# EAGLE design kfly_v3.0 (EAGLE 6.5.0)

## Sheet 1 of 8: MCU
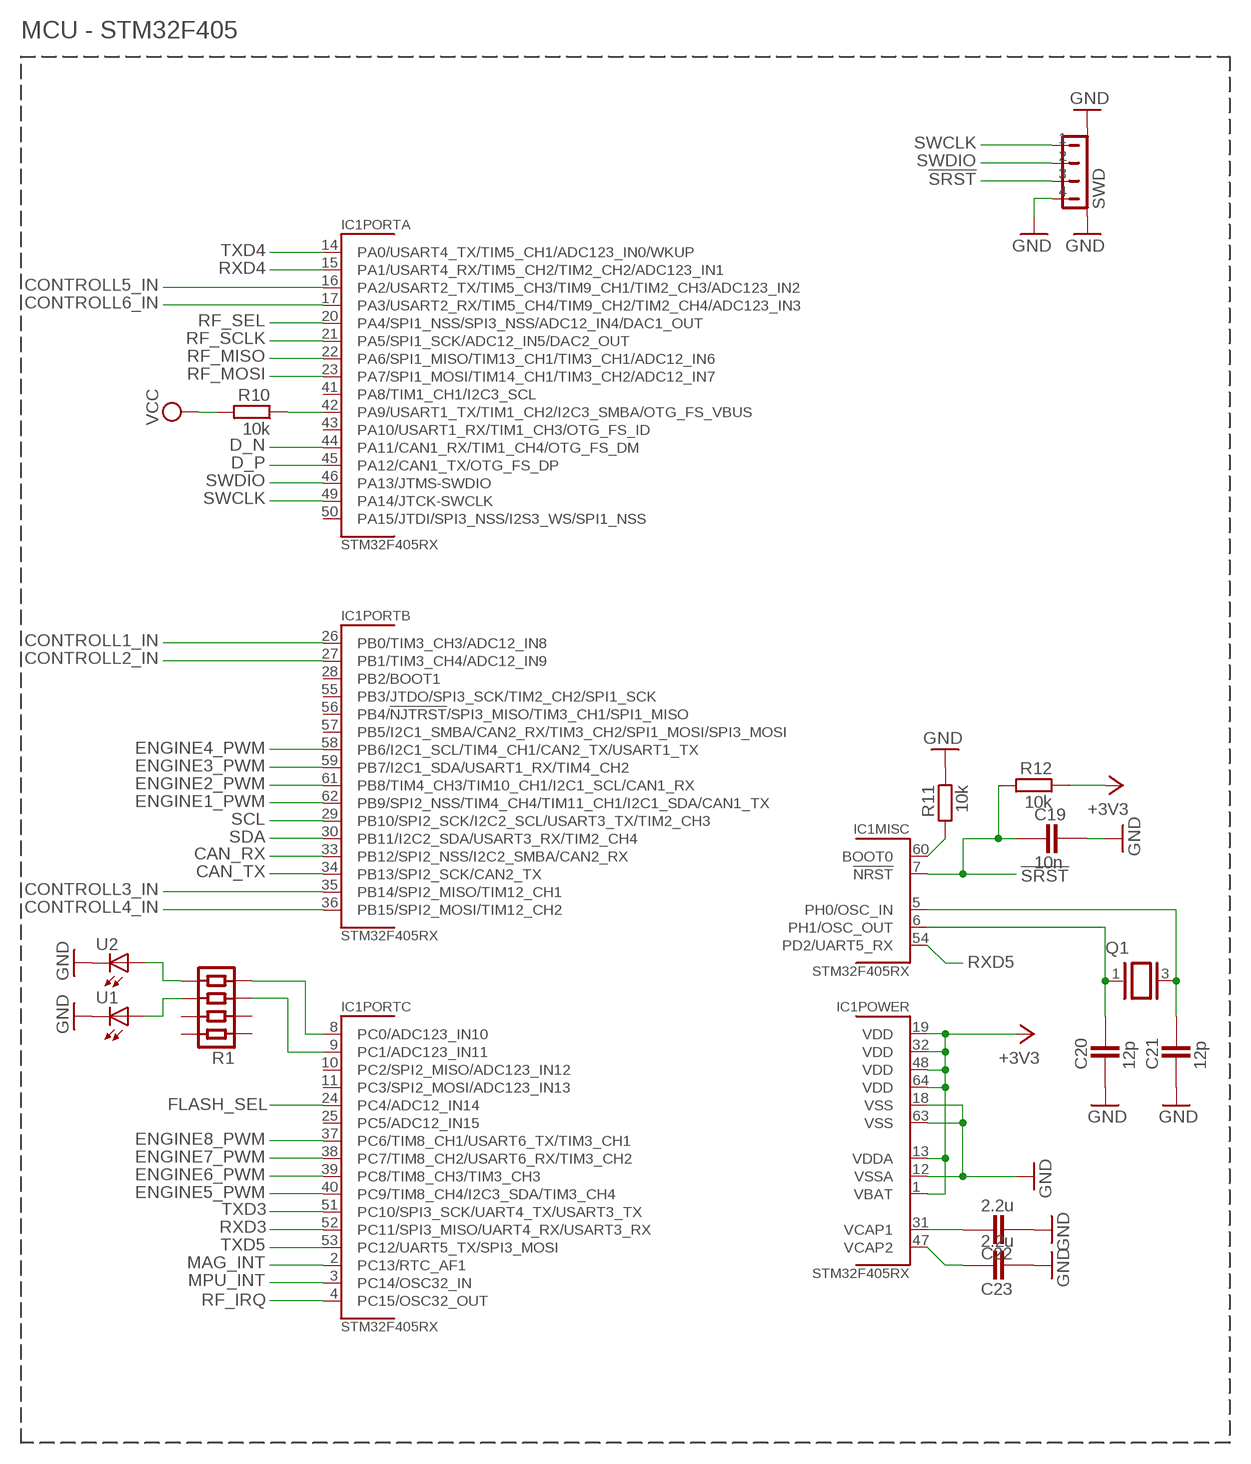
[diagram p0: schematic, sheet 1]

### Parts
C19  10n  CAPACITOR_0402  [CAPC1005X60N]
C20  12p  CAPACITOR_0402  [CAPC1005X60N]
C21  12p  CAPACITOR_0402  [CAPC1005X60N]
C22  2.2u  CAPACITOR_0603  [CAPC1608X92N]
C23  2.2u  CAPACITOR_0603  [CAPC1608X92N]
IC1  STM32F405RX  STM32F4X5RX  [LQFP64-10X10]
Q1  2.5X3.2CRYSTAL  [2.5X3.2CRYSTAL]
R1  RESISTOR-4ARRAY-0804  [RESISTORARRAY_0804]
R10  10k  RESISTOR_0402  [RESC1005X40AN]
R11  10k  RESISTOR_0402  [RESC1005X40AN]
R12  10k  RESISTOR_0402  [RESC1005X40AN]
SWD  JST-4PIN-SIDE-1.0  [JST-4PIN-SIDE]
U1  LED0603  [LED-0603]
U2  LED0603  [LED-0603]

### Nets
!SRST: C19.1 IC1.7(MISC:!NRST!) R12.2 SWD.3
+3V3: IC1.1(POWER:VBAT) IC1.13(POWER:VDDA) IC1.19(POWER:VDD) IC1.32(POWER:VDD) IC1.48(POWER:VDD) IC1.64(POWER:VDD) R12.1 ; also sheet 2,3,4,6,8
CAN_RX: IC1.33(PORTB:PB12/SPI2_NSS/I2C2_SMBA/CAN2_RX) ; also sheet 6
CAN_TX: IC1.34(PORTB:PB13/SPI2_SCK/CAN2_TX) ; also sheet 6
CONTROLL1_IN: IC1.26(PORTB:PB0/TIM3_CH3/ADC12_IN8) ; also sheet 6
CONTROLL2_IN: IC1.27(PORTB:PB1/TIM3_CH4/ADC12_IN9) ; also sheet 6
CONTROLL3_IN: IC1.35(PORTB:PB14/SPI2_MISO/TIM12_CH1) ; also sheet 6
CONTROLL4_IN: IC1.36(PORTB:PB15/SPI2_MOSI/TIM12_CH2) ; also sheet 6
CONTROLL5_IN: IC1.16(PORTA:PA2/USART2_TX/TIM5_CH3/TIM9_CH1/TIM2_CH3/ADC123_IN2) ; also sheet 6
CONTROLL6_IN: IC1.17(PORTA:PA3/USART2_RX/TIM5_CH4/TIM9_CH2/TIM2_CH4/ADC123_IN3) ; also sheet 6
D_N: IC1.44(PORTA:PA11/CAN1_RX/TIM1_CH4/OTG_FS_DM) ; also sheet 5
D_P: IC1.45(PORTA:PA12/CAN1_TX/OTG_FS_DP) ; also sheet 5
ENGINE1_PWM: IC1.62(PORTB:PB9/SPI2_NSS/TIM4_CH4/TIM11_CH1/I2C1_SDA/CAN1_TX) ; also sheet 7
ENGINE2_PWM: IC1.61(PORTB:PB8/TIM4_CH3/TIM10_CH1/I2C1_SCL/CAN1_RX) ; also sheet 7
ENGINE3_PWM: IC1.59(PORTB:PB7/I2C1_SDA/USART1_RX/TIM4_CH2) ; also sheet 7
ENGINE4_PWM: IC1.58(PORTB:PB6/I2C1_SCL/TIM4_CH1/CAN2_TX/USART1_TX) ; also sheet 7
ENGINE5_PWM: IC1.40(PORTC:PC9/TIM8_CH4/I2C3_SDA/TIM3_CH4) ; also sheet 7
ENGINE6_PWM: IC1.39(PORTC:PC8/TIM8_CH3/TIM3_CH3) ; also sheet 7
ENGINE7_PWM: IC1.38(PORTC:PC7/TIM8_CH2/USART6_RX/TIM3_CH2) ; also sheet 7
ENGINE8_PWM: IC1.37(PORTC:PC6/TIM8_CH1/USART6_TX/TIM3_CH1) ; also sheet 7
FLASH_SEL: IC1.24(PORTC:PC4/ADC12_IN14) ; also sheet 3
GND: C19.2 C20.1 C21.1 C22.2 C23.2 IC1.12(POWER:VSSA) IC1.18(POWER:VSS) IC1.63(POWER:VSS) R11.1 SWD.4 SWD.NC1(P1) SWD.NC2(P2) U1.C U2.C ; also sheet 2,3,4,5,6,7,8
MAG_INT: IC1.2(PORTC:PC13/RTC_AF1) ; also sheet 4
MPU_INT: IC1.3(PORTC:PC14/OSC32_IN) ; also sheet 4
N$11: R1.5 U2.A
N$18: R1.6 U1.A
N$19: IC1.60(MISC:BOOT0) R11.2
N$20: IC1.8(PORTC:PC0/ADC123_IN10) R1.4
N$24: IC1.9(PORTC:PC1/ADC123_IN11) R1.3
N$25: C20.2 IC1.6(MISC:PH1/OSC_OUT) Q1.1
N$26: C21.2 IC1.5(MISC:PH0/OSC_IN) Q1.3
N$35: IC1.42(PORTA:PA9/USART1_TX/TIM1_CH2/I2C3_SMBA/OTG_FS_VBUS) R10.1
N$44: C22.1 IC1.31(POWER:VCAP1)
N$50: C23.1 IC1.47(POWER:VCAP2)
RF_IRQ: IC1.4(PORTC:PC15/OSC32_OUT) ; also sheet 8
RF_MISO: IC1.22(PORTA:PA6/SPI1_MISO/TIM13_CH1/TIM3_CH1/ADC12_IN6) ; also sheet 3,8
RF_MOSI: IC1.23(PORTA:PA7/SPI1_MOSI/TIM14_CH1/TIM3_CH2/ADC12_IN7) ; also sheet 3,8
RF_SCLK: IC1.21(PORTA:PA5/SPI1_SCK/ADC12_IN5/DAC2_OUT) ; also sheet 3,8
RF_SEL: IC1.20(PORTA:PA4/SPI1_NSS/SPI3_NSS/ADC12_IN4/DAC1_OUT) ; also sheet 8
RXD3: IC1.52(PORTC:PC11/SPI3_MISO/UART4_RX/USART3_RX) ; also sheet 6
RXD4: IC1.15(PORTA:PA1/USART4_RX/TIM5_CH2/TIM2_CH2/ADC123_IN1) ; also sheet 6
RXD5: IC1.54(MISC:PD2/UART5_RX) ; also sheet 6
SCL: IC1.29(PORTB:PB10/SPI2_SCK/I2C2_SCL/USART3_TX/TIM2_CH3) ; also sheet 4
SDA: IC1.30(PORTB:PB11/I2C2_SDA/USART3_RX/TIM2_CH4) ; also sheet 4
SWCLK: IC1.49(PORTA:PA14/JTCK-SWCLK) SWD.1
SWDIO: IC1.46(PORTA:PA13/JTMS-SWDIO) SWD.2
TXD3: IC1.51(PORTC:PC10/SPI3_SCK/UART4_TX/USART3_TX) ; also sheet 6
TXD4: IC1.14(PORTA:PA0/USART4_TX/TIM5_CH1/ADC123_IN0/WKUP) ; also sheet 6
TXD5: IC1.53(PORTC:PC12/UART5_TX/SPI3_MOSI) ; also sheet 6
VCC: R10.2 ; also sheet 2,5
Unconnected: IC1.10(PORTC:PC2/SPI2_MISO/ADC123_IN12) IC1.11(PORTC:PC3/SPI2_MOSI/ADC123_IN13) IC1.25(PORTC:PC5/ADC12_IN15) IC1.28(PORTB:PB2/BOOT1) IC1.41(PORTA:PA8/TIM1_CH1/I2C3_SCL) IC1.43(PORTA:PA10/USART1_RX/TIM1_CH3/OTG_FS_ID) IC1.50(PORTA:PA15/JTDI/SPI3_NSS/I2S3_WS/SPI1_NSS) IC1.55(PORTB:PB3/JTDO/SPI3_SCK/TIM2_CH2/SPI1_SCK) IC1.56(PORTB:PB4/!NJTRST!/SPI3_MISO/TIM3_CH1/SPI1_MISO) IC1.57(PORTB:PB5/I2C1_SMBA/CAN2_RX/TIM3_CH2/SPI1_MOSI/SPI3_MOSI) R1.1 R1.2 R1.7 R1.8

### Notes on the sheet
- MCU - STM32F405

## Sheet 2 of 8: Power supply
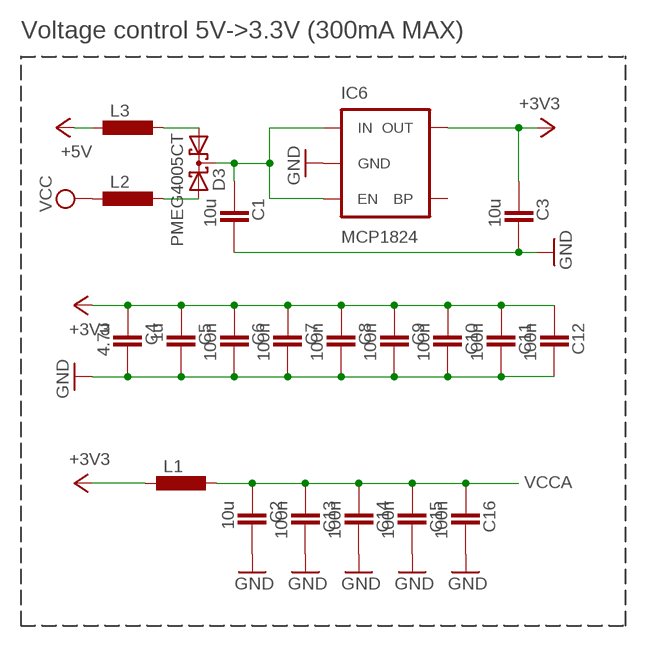
[diagram p1: schematic, sheet 2]

### Parts
C1  10u  CAPACITOR_0603  [CAPC1608X92N]
C2  10u  CAPACITOR_0603  [CAPC1608X92N]
C3  10u  CAPACITOR_0603  [CAPC1608X92N]
C4  4.7u  CAPACITOR_0603  [CAPC1608X92N]
C5  1u  CAPACITOR_0603  [CAPC1608X92N]
C6  100n  CAPACITOR_0402  [CAPC1005X60N]
C7  100n  CAPACITOR_0402  [CAPC1005X60N]
C8  100n  CAPACITOR_0402  [CAPC1005X60N]
C9  100n  CAPACITOR_0402  [CAPC1005X60N]
C10  100n  CAPACITOR_0402  [CAPC1005X60N]
C11  100n  CAPACITOR_0402  [CAPC1005X60N]
C12  100n  CAPACITOR_0402  [CAPC1005X60N]
C13  100n  CAPACITOR_0402  [CAPC1005X60N]
C14  100n  CAPACITOR_0402  [CAPC1005X60N]
C15  100n  CAPACITOR_0402  [CAPC1005X60N]
C16  100n  CAPACITOR_0402  [CAPC1005X60N]
D3  PMEG4005CT  BAS40-05  [SOT23]
IC6  MCP1824  V_REG_LDOSMD  [SOT23-5]
L1  INDUCTOR_0603  [INDC1608X95N]
L2  INDUCTOR_0603  [INDC1608X95N]
L3  INDUCTOR_0603  [INDC1608X95N]

### Nets
+3V3: C3.1 C4.1 C5.1 C6.1 C7.1 C8.1 C9.1 C10.1 C11.1 C12.1 IC6.5(OUT) L1.1 ; also sheet 1,3,4,6,8
+5V: L3.1 ; also sheet 6,7
GND: C1.2 C2.2 C3.2 C4.2 C5.2 C6.2 C7.2 C8.2 C9.2 C10.2 C11.2 C12.2 C13.2 C14.2 C15.2 C16.2 IC6.2(GND) ; also sheet 1,3,4,5,6,7,8
N$21: D3.2(A2) L2.2
N$45: D3.1(A1) L3.2
V_RC: C1.1 D3.3(C) IC6.1(IN) IC6.3(EN)
VCC: L2.1 ; also sheet 1,5
VCCA: C2.1 C13.1 C14.1 C15.1 C16.1 L1.2 ; also sheet 4
Unconnected: IC6.4(BP)

### Notes on the sheet
- Voltage control 5V->3.3V (300mA MAX)

## Sheet 3 of 8: Flash Memory
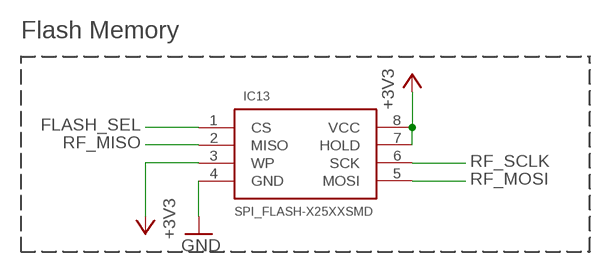
[diagram p2: schematic, sheet 3]

### Parts
IC13  SPI_FLASH-X25XXSMD  [SO08]

### Nets
+3V3: IC13.3(WP) IC13.7(HOLD) IC13.8(VCC) ; also sheet 1,2,4,6,8
FLASH_SEL: IC13.1(CS) ; also sheet 1
GND: IC13.4(GND) ; also sheet 1,2,4,5,6,7,8
RF_MISO: IC13.2(MISO) ; also sheet 1,8
RF_MOSI: IC13.5(MOSI) ; also sheet 1,8
RF_SCLK: IC13.6(SCK) ; also sheet 1,8

### Notes on the sheet
- Flash Memory

## Sheet 4 of 8: Sensors and their power suppy
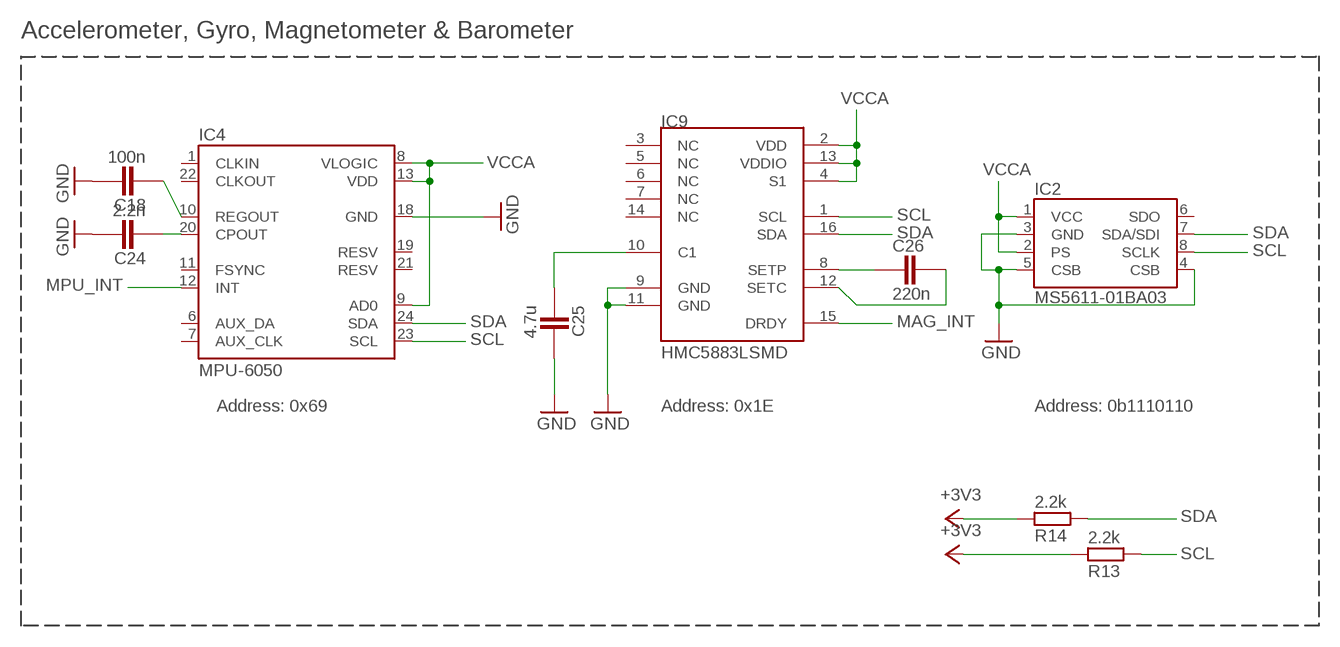
[diagram p3: schematic, sheet 4]

### Parts
C18  100n  CAPACITOR_0402  [CAPC1005X60N]
C24  2.2n  CAPACITOR_0402  [CAPC1005X60N]
C25  4.7u  CAPACITOR_0603  [CAPC1608X92N]
C26  220n  CAPACITOR_0603  [CAPC1608X92N]
IC2  MS5611-01BA03  MS5611-01BA01  [MS5611]
IC4  MPU-6050  [QFN-24]
IC9  HMC5883LSMD  [16LPCC]
R13  2.2k  RESISTOR_0402  [RESC1005X40AN]
R14  2.2k  RESISTOR_0402  [RESC1005X40AN]

### Nets
+3V3: R13.1 R14.1 ; also sheet 1,2,3,6,8
GND: C18.2 C24.2 C25.2 IC2.3(GND) IC2.4(CSB) IC2.5(CSB) IC4.18(GND) IC9.9(GND) IC9.11(GND) ; also sheet 1,2,3,5,6,7,8
MAG_INT: IC9.15(DRDY) ; also sheet 1
MPU_INT: IC4.12(INT) ; also sheet 1
N$1: C25.1 IC9.10(C1)
N$8: C26.1 IC9.8(SETP)
N$10: C26.2 IC9.12(SETC)
N$13: C18.1 IC4.10(REGOUT)
N$14: C24.1 IC4.20(CPOUT)
SCL: IC2.8(SCLK) IC4.23(SCL) IC9.1(SCL) R13.2 ; also sheet 1
SDA: IC2.7(SDA/SDI) IC4.24(SDA) IC9.16(SDA) R14.2 ; also sheet 1
VCCA: IC2.1(VCC) IC2.2(PS) IC4.8(VLOGIC) IC4.9(AD0) IC4.13(VDD) IC9.2(VDD) IC9.4(S1) IC9.13(VDDIO) ; also sheet 2
Unconnected: IC2.6(SDO) IC4.1(CLKIN) IC4.6(AUX_DA) IC4.7(AUX_CLK) IC4.11(FSYNC) IC4.19(RESV) IC4.21(RESV) IC4.22(CLKOUT) IC9.3(NC) IC9.5(NC) IC9.6(NC) IC9.7(NC) IC9.14(NC)

### Notes on the sheet
- Accelerometer, Gyro, Magnetometer & Barometer
- Address: 0x69 | Address: 0x1E | Address: 0b1110110

## Sheet 5 of 8: USB and JTAG
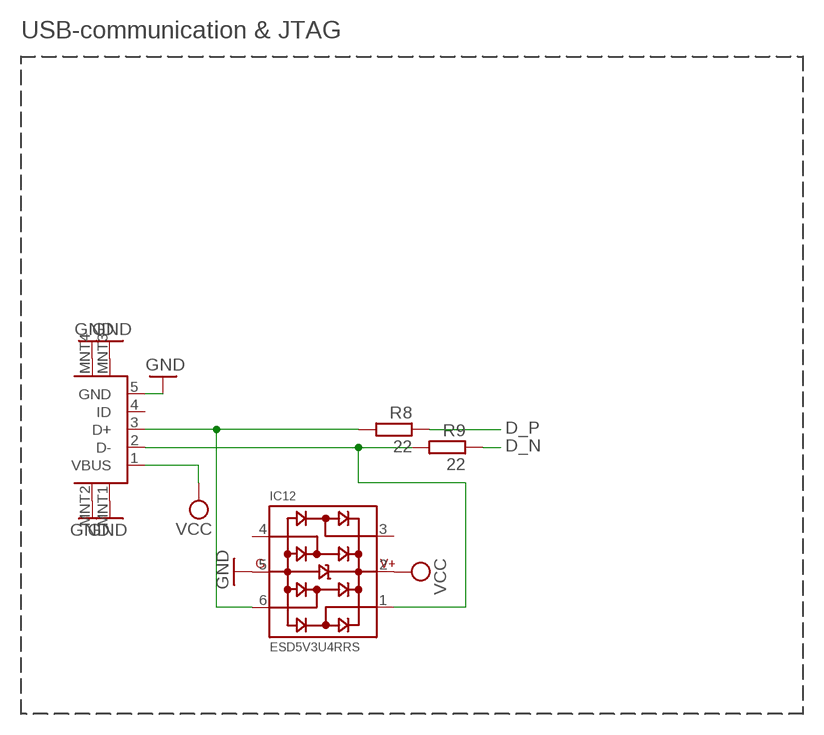
[diagram p4: schematic, sheet 5]

### Parts
IC12  ESD5V3U4RRS  [SOT363]
R8  22  RESISTOR_0402  [RESC1005X40AN]
R9  22  RESISTOR_0402  [RESC1005X40AN]
USB1  USB-MICRO-B-BOTTOM  [MICROUSB_TYPEB_SURFACE]

### Nets
D_N: R9.1 ; also sheet 1
D_P: R8.1 ; also sheet 1
GND: IC12.5 USB1.5(GND) USB1.MNT1(MTN1) USB1.MNT2(MTN2) USB1.MNT3(MTN3) USB1.MNT4(MTN4) ; also sheet 1,2,3,4,6,7,8
N$2: IC12.6 R8.2 USB1.3(D+)
N$7: IC12.1 R9.2 USB1.2(D-)
VCC: IC12.2 USB1.1(VBUS) ; also sheet 1,2
Unconnected: IC12.3 IC12.4 USB1.4(ID)

### Notes on the sheet
- USB-communication & JTAG

## Sheet 6 of 8: Communication Input and Outputs
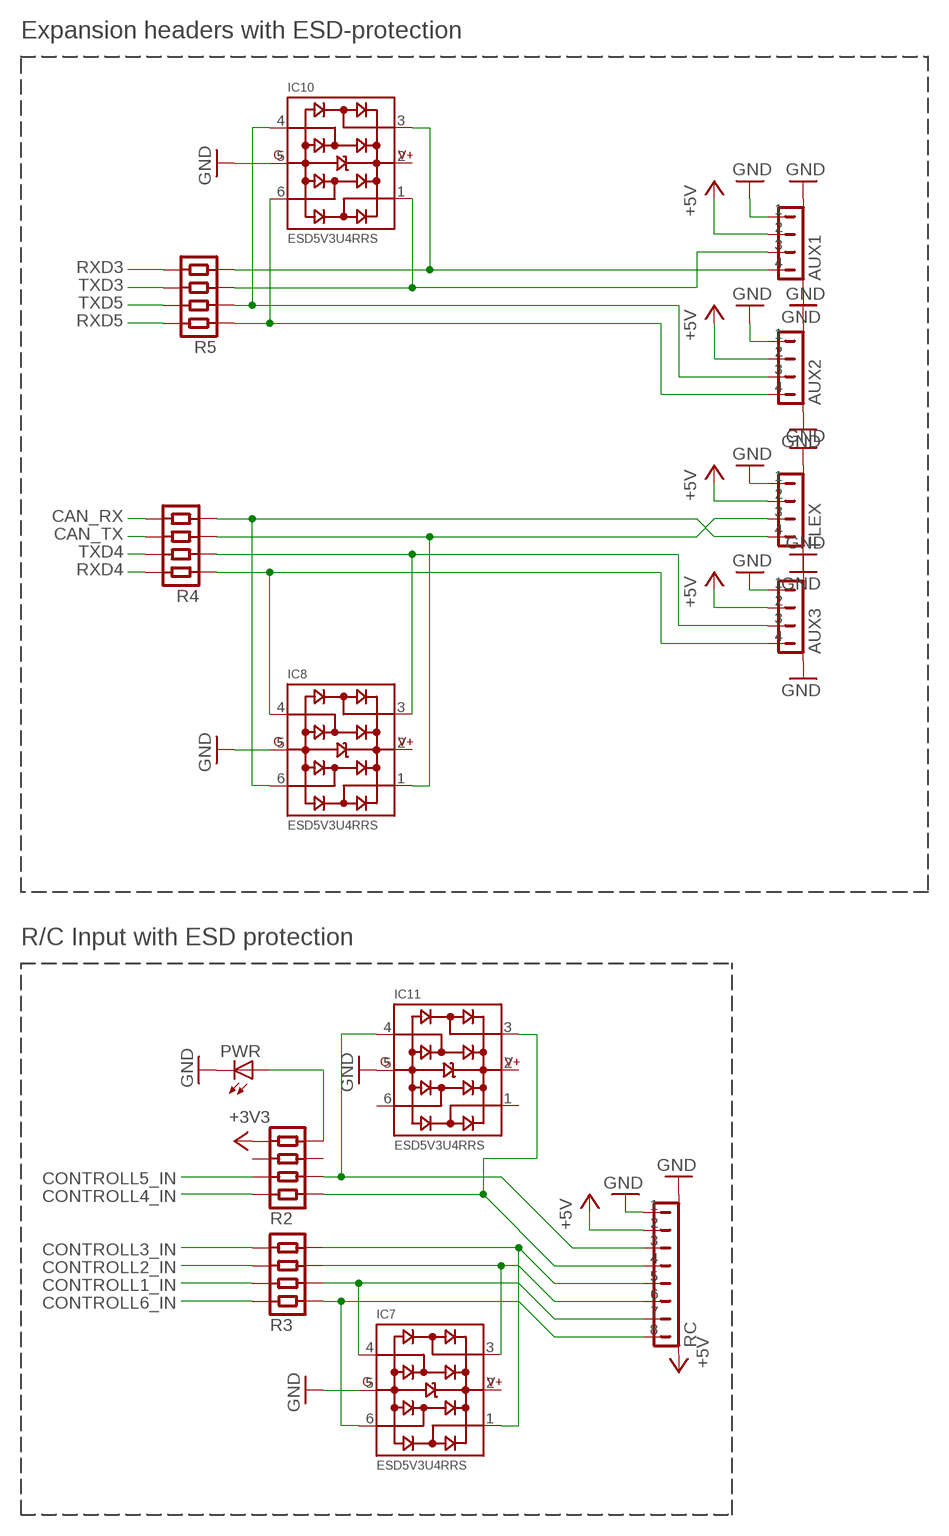
[diagram p5: schematic, sheet 6]

### Parts
AUX1  JST-4PIN-SIDE-1.0  [JST-4PIN-SIDE]
AUX2  JST-4PIN-SIDE-1.0  [JST-4PIN-SIDE]
AUX3  JST-4PIN-SIDE-1.0  [JST-4PIN-SIDE]
FLEX  JST-4PIN-SIDE-1.0  [JST-4PIN-SIDE]
IC7  ESD5V3U4RRS  [SOT363]
IC8  ESD5V3U4RRS  [SOT363]
IC10  ESD5V3U4RRS  [SOT363]
IC11  ESD5V3U4RRS  [SOT363]
PWR  LED0603  [LED-0603]
R2  RESISTOR-4ARRAY-0804  [RESISTORARRAY_0804]
R3  RESISTOR-4ARRAY-0804  [RESISTORARRAY_0804]
R4  RESISTOR-4ARRAY-0804  [RESISTORARRAY_0804]
R5  RESISTOR-4ARRAY-0804  [RESISTORARRAY_0804]
RC  JST-8PIN-SIDE-1.0  [JST-8PIN-SIDE]

### Nets
+3V3: R2.4 ; also sheet 1,2,3,4,8
+5V: AUX1.2 AUX2.2 AUX3.2 FLEX.2 RC.2 RC.NC2(GND2) ; also sheet 2,7
CAN_RX: R4.5 ; also sheet 1
CAN_TX: R4.6 ; also sheet 1
CONTROLL1_IN: R3.2 ; also sheet 1
CONTROLL2_IN: R3.3 ; also sheet 1
CONTROLL3_IN: R3.4 ; also sheet 1
CONTROLL4_IN: R2.1 ; also sheet 1
CONTROLL5_IN: R2.2 ; also sheet 1
CONTROLL6_IN: R3.1 ; also sheet 1
GND: AUX1.1 AUX1.NC1(P1) AUX1.NC2(P2) AUX2.1 AUX2.NC1(P1) AUX2.NC2(P2) AUX3.1 AUX3.NC1(P1) AUX3.NC2(P2) FLEX.1 FLEX.NC1(P1) FLEX.NC2(P2) IC7.5 IC8.5 IC10.5 IC11.5 PWR.C RC.1 RC.NC1(GND1) ; also sheet 1,2,3,4,5,7,8
N$6: AUX2.3 IC10.4 R5.2
N$9: PWR.A R2.5
N$23: IC11.4 R2.7 RC.3
N$27: IC7.6 R3.8 RC.8
N$28: IC7.1 R3.5 RC.5
N$30: FLEX.4 IC8.6 R4.4
N$31: FLEX.3 IC8.1 R4.3
N$40: AUX2.4 IC10.6 R5.1
N$46: IC11.3 R2.8 RC.4
N$49: IC7.3 R3.6 RC.6
N$51: AUX1.4 IC10.3 R5.4
N$52: AUX1.3 IC10.1 R5.3
N$55: AUX3.4 IC8.4 R4.1
N$70: AUX3.3 IC8.3 R4.2
N$78: IC7.4 R3.7 RC.7
RXD3: R5.5 ; also sheet 1
RXD4: R4.8 ; also sheet 1
RXD5: R5.8 ; also sheet 1
TXD3: R5.6 ; also sheet 1
TXD4: R4.7 ; also sheet 1
TXD5: R5.7 ; also sheet 1
Unconnected: IC7.2 IC8.2 IC10.2 IC11.1 IC11.2 IC11.6 R2.3 R2.6

### Notes on the sheet
- Expansion headers with ESD-protection
- R/C Input with ESD protection

## Sheet 7 of 8: PPM out
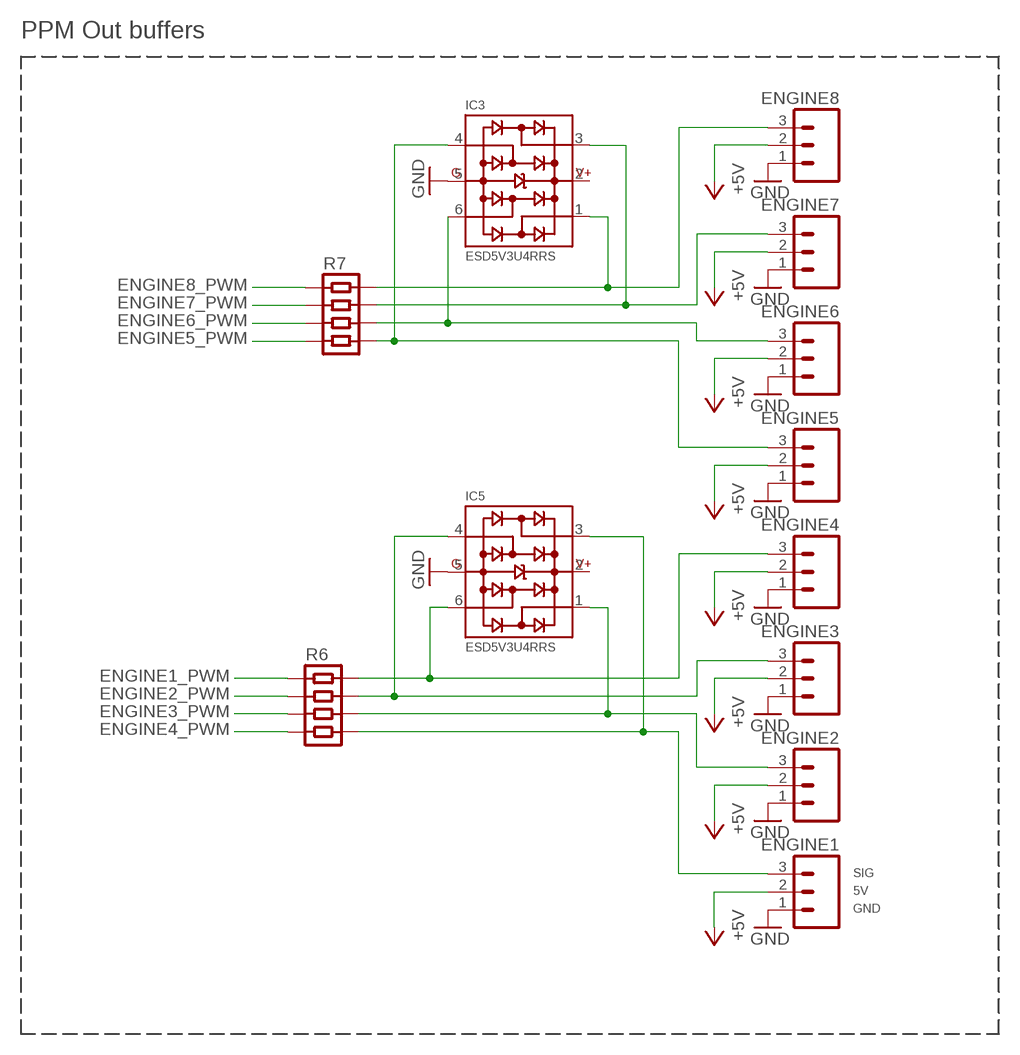
[diagram p6: schematic, sheet 7]

### Parts
ENGINE1  M03  [M03]
ENGINE2  M03  [M03]
ENGINE3  M03  [M03]
ENGINE4  M03  [M03]
ENGINE5  M03  [M03]
ENGINE6  M03  [M03]
ENGINE7  M03  [M03]
ENGINE8  M03  [M03]
IC3  ESD5V3U4RRS  [SOT363]
IC5  ESD5V3U4RRS  [SOT363]
R6  RESISTOR-4ARRAY-0804  [RESISTORARRAY_0804]
R7  RESISTOR-4ARRAY-0804  [RESISTORARRAY_0804]

### Nets
+5V: ENGINE1.2 ENGINE2.2 ENGINE3.2 ENGINE4.2 ENGINE5.2 ENGINE6.2 ENGINE7.2 ENGINE8.2 ; also sheet 2,6
ENGINE1_PWM: R6.1 ; also sheet 1
ENGINE2_PWM: R6.2 ; also sheet 1
ENGINE3_PWM: R6.3 ; also sheet 1
ENGINE4_PWM: R6.4 ; also sheet 1
ENGINE5_PWM: R7.4 ; also sheet 1
ENGINE6_PWM: R7.3 ; also sheet 1
ENGINE7_PWM: R7.2 ; also sheet 1
ENGINE8_PWM: R7.1 ; also sheet 1
GND: ENGINE1.1 ENGINE2.1 ENGINE3.1 ENGINE4.1 ENGINE5.1 ENGINE6.1 ENGINE7.1 ENGINE8.1 IC3.5 IC5.5 ; also sheet 1,2,3,4,5,6,8
N$3: ENGINE8.3 IC3.1 R7.8
N$4: ENGINE7.3 IC3.3 R7.7
N$5: ENGINE6.3 IC3.6 R7.6
N$12: ENGINE5.3 IC3.4 R7.5
N$16: ENGINE2.3 IC5.1 R6.6
N$17: ENGINE1.3 IC5.3 R6.5
N$22: ENGINE4.3 IC5.6 R6.8
N$29: ENGINE3.3 IC5.4 R6.7
Unconnected: IC3.2 IC5.2

### Notes on the sheet
- PPM Out buffers
- SIG
- 5V
- GND

## Sheet 8 of 8: RF
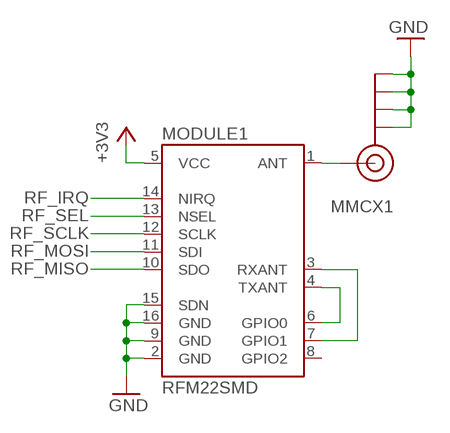
[diagram p7: schematic, sheet 8]

### Parts
MMCX1  MMCX  [MMCX_THROUGHHOLE_RIGHTANGLE]
MODULE1  RFM22SMD  [RFM22-XXX-S2]

### Nets
+3V3: MODULE1.5(VCC) ; also sheet 1,2,3,4,6
GND: MMCX1.G1(GND) MMCX1.G2(GND) MMCX1.G3(GND) MMCX1.G4(GND) MODULE1.2(GND) MODULE1.9(GND) MODULE1.15(SDN) MODULE1.16(GND) ; also sheet 1,2,3,4,5,6,7
N$56: MMCX1.S(SIGNAL) MODULE1.1(ANT)
N$67: MODULE1.4(TXANT) MODULE1.6(GPIO0)
N$68: MODULE1.3(RXANT) MODULE1.7(GPIO1)
RF_IRQ: MODULE1.14(NIRQ) ; also sheet 1
RF_MISO: MODULE1.10(SDO) ; also sheet 1,3
RF_MOSI: MODULE1.11(SDI) ; also sheet 1,3
RF_SCLK: MODULE1.12(SCLK) ; also sheet 1,3
RF_SEL: MODULE1.13(NSEL) ; also sheet 1
Unconnected: MODULE1.8(GPIO2)

## Library data of the parts
AUX1-AUX3 FLEX SWD = korken:JST-4PIN-SIDE-1.0
C1-C16 C18-C26 = ipc-7351-capacitor:CAPACITOR_
D3 = diode:BAS40-05: Silicon Schottky Diodes General-purpose diode for high-speed switching
ENGINE1-ENGINE8 = korken:M03
IC1 = korken:STM32F4X5RX
IC2 = korken:MS5611-01BA01
IC3 IC5 IC7 IC8 IC10-IC12 = korken:ESD5V3U4RRS
IC4 = korken:MPU-6050
IC6 = SparkFun:V_REG_LDO: Voltage Regulator LDO Standard 150mA LDO voltage regulator in SOT-23 layout. Micrel part MIC5205. BP (by-pass) pin is used to lower output noise with 470pF cap.
IC9 = SparkFun:HMC5883L: 3 Axis Digital Compass IC
IC13 = SparkFun:SPI_FLASH-X25XX: 8pin SPI Flash series x25xx. Works with devices like W25X32 and BR25L32
L1-L3 = ipc-7351-inductor:INDUCTOR_
MMCX1 = korken:MMCX
MODULE1 = SparkFun:RFM22: Description: The RFM22 is a low-power, low cost radio that is capable of operating in the 434MHz and 900MHz open bands. It's frequency is software defined and there are some very good libraries written for it.
PWR U1 U2 = SparkFun:LED: LEDs Standard schematic elements and footprints for 5mm, 3mm, 1206, and 0603 sized LEDs. 5mm - Spark Fun Electronics SKU : COM-00529 (and others)
Q1 = korken:2.5X3.2CRYSTAL
R1-R7 = korken:RESISTOR-4ARRAY-0804
R8-R14 = ipc-7351-resistor:RESISTOR_
RC = korken:JST-8PIN-SIDE-1.0
USB1 = korken:USB-MICRO-B-BOTTOM

## Board
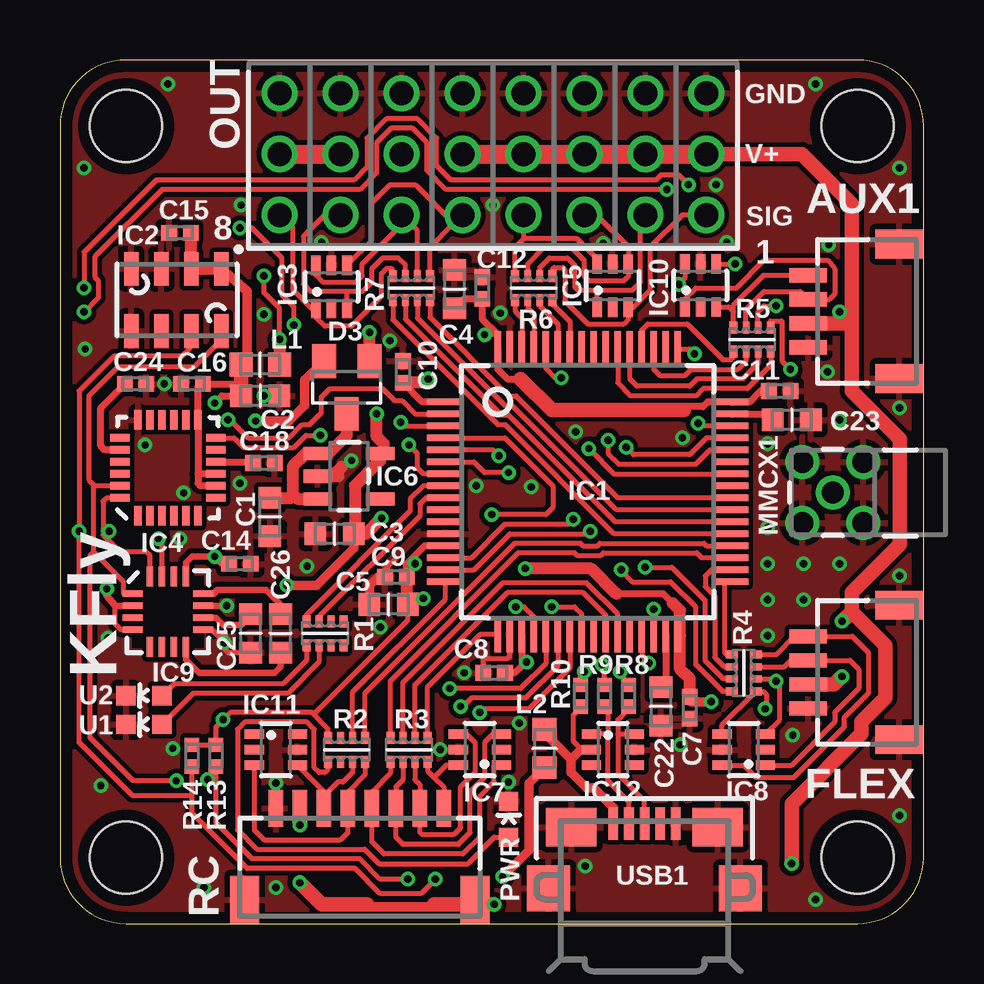
[diagram p8: board, top side]
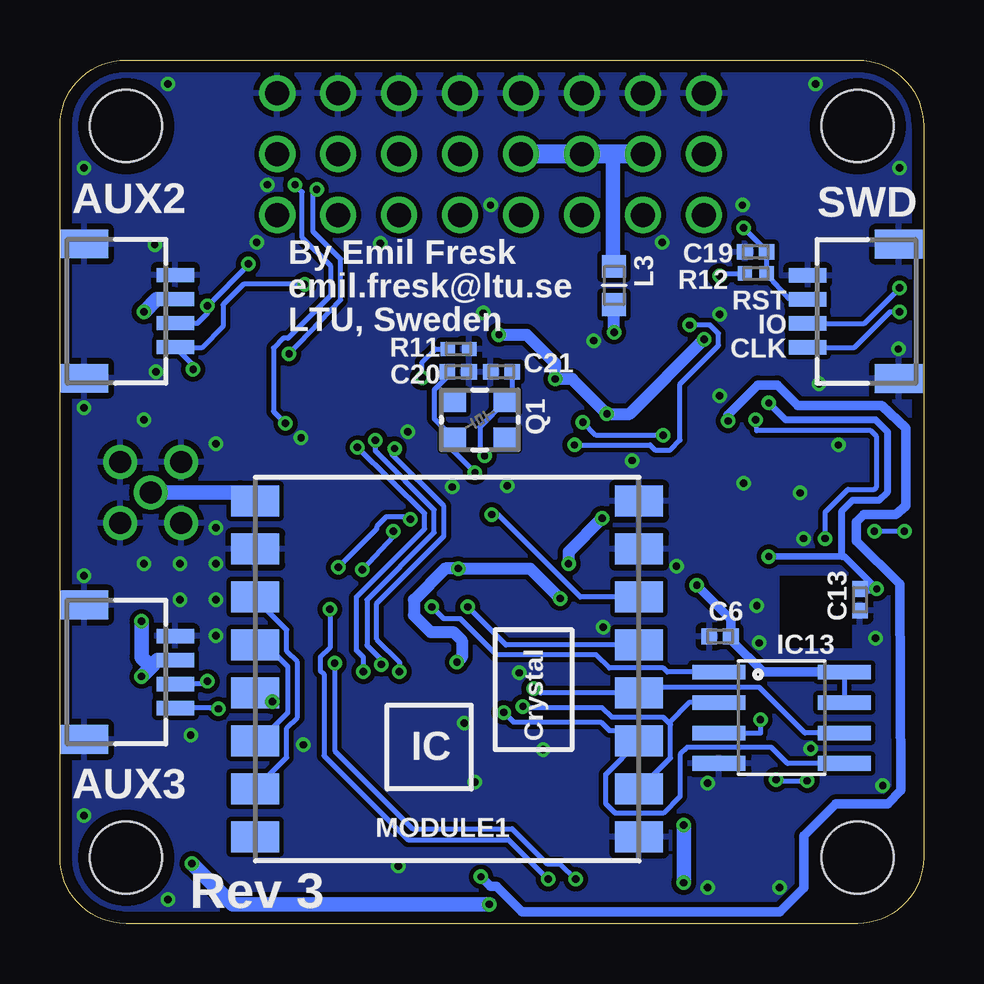
[diagram p9: board, bottom side, seen from below]

Size 36 x 36 mm. Coordinates in mm from the lower left corner, seen from the top.
Outline: 0,33.25 0,2.75 arc90 2.75,0 33.25,0 arc90 36,2.75 36,33.25 arc90 33.25,36 2.75,36 arc90 0,33.25
Copper layers (1*2*15*16): Top 0.035mm / dielectric 0.4mm / InnerTop 0.035mm / dielectric 0.4mm / InnerBottom 0.035mm / dielectric 0.4mm / Bottom 0.035mm
Design rules "korken_default *": minimum track width 0.15mm, minimum drill 0.3mm, track to track 0.15mm, track to pad 0.15mm, pad to pad 0.15mm, via to via 0.15mm, smd to smd 0mil, copper to edge 0.5mm, drill to drill 0.25mm, minimum pad ring 10mil, minimum via ring 6mil, stop-mask expansion 0.05mm, vias tented up to drill 0.4mm, thermal gap 0.25mm
Holes 3 mm at 2.75,2.75 33.25,2.75 33.25,33.25 2.75,33.25

### Footprints (pad centres in the part's own frame; a part is rotated, then mirrored left to right if it is on the bottom)
JST-4PIN-SIDE = smd 0.6 x 1.55: 1 1.48,-2.81; 2 0.48,-2.81; 3 -0.52,-2.81; 4 -1.52,-2.81 | smd 1.2 x 2: NC1 2.78,0.99; NC2 -2.82,0.99
CAPC1608X92N = smd 0.9 x 0.95: 1 -0.8,0; 2 0.8,0
CAPC1005X60N = smd 0.65 x 0.65: 1 -0.45,0; 2 0.45,0
SOT23 = smd 1 x 1.4: 1 -0.95,-1.1; 2 0.95,-1.1; 3 0,1.1
M03 = drill 1: 1 -2.54,0; 2 0,0; 3 2.54,0
LQFP64-10X10 = smd 0.28 x 1.5: 1 -3.75,-5.95; 2 -3.25,-5.95; 3 -2.75,-5.95; 4 -2.25,-5.95; 5 -1.75,-5.95; 6 -1.25,-5.95; 7 -0.75,-5.95; 8 -0.25,-5.95; 9 0.25,-5.95; 10 0.75,-5.95; 11 1.25,-5.95; 12 1.75,-5.95; 13 2.25,-5.95; 14 2.75,-5.95; 15 3.25,-5.95; 16 3.75,-5.95; 33 3.75,5.95; 34 3.25,5.95; 35 2.75,5.95; 36 2.25,5.95; 37 1.75,5.95; 38 1.25,5.95; 39 0.75,5.95; 40 0.25,5.95; 41 -0.25,5.95; 42 -0.75,5.95; 43 -1.25,5.95; 44 -1.75,5.95; 45 -2.25,5.95; 46 -2.75,5.95; 47 -3.25,5.95; 48 -3.75,5.95 | smd 1.5 x 0.28: 17 5.95,-3.75; 18 5.95,-3.25; 19 5.95,-2.75; 20 5.95,-2.25; 21 5.95,-1.75; 22 5.95,-1.25; 23 5.95,-0.75; 24 5.95,-0.25; 25 5.95,0.25; 26 5.95,0.75; 27 5.95,1.25; 28 5.95,1.75; 29 5.95,2.25; 30 5.95,2.75; 31 5.95,3.25; 32 5.95,3.75; 49 -5.95,3.75; 50 -5.95,3.25; 51 -5.95,2.75; 52 -5.95,2.25; 53 -5.95,1.75; 54 -5.95,1.25; 55 -5.95,0.75; 56 -5.95,0.25; 57 -5.95,-0.25; 58 -5.95,-0.75; 59 -5.95,-1.25; 60 -5.95,-1.75; 61 -5.95,-2.25; 62 -5.95,-2.75; 63 -5.95,-3.25; 64 -5.95,-3.75
MS5611 = smd 1.4 x 0.6: 1 -1.3,1.875; 2 -1.3,0.625; 3 -1.3,-0.625; 4 -1.3,-1.875; 5 1.3,-1.875; 6 1.3,-0.625; 7 1.3,0.625; 8 1.3,1.875
SOT363 = smd 0.4 x 0.8: 1 -0.65,-0.9; 2 0,-0.9; 3 0.65,-0.9; 4 0.65,0.9; 5 0,0.9; 6 -0.65,0.9
QFN-24 = smd 0.8 x 0.3: 1 -2,1.25; 2 -2,0.75; 3 -2,0.25; 4 -2,-0.25; 5 -2,-0.75; 6 -2,-1.25; 13 2,-1.25; 14 2,-0.75; 15 2,-0.25; 16 2,0.25; 17 2,0.75; 18 2,1.25 | smd 0.3 x 0.8: 7 -1.25,-2; 8 -0.75,-2; 9 -0.25,-2; 10 0.25,-2; 11 0.75,-2; 12 1.25,-2; 19 1.25,2; 20 0.75,2; 21 0.25,2; 22 -0.25,2; 23 -0.75,2; 24 -1.25,2
SOT23-5 = smd 0.55 x 1.2: 1 -0.95,-1.3; 2 0,-1.3; 3 0.95,-1.3; 4 0.95,1.3; 5 -0.95,1.3
16LPCC = smd 0.85 x 0.28: 1 -1.47,0.75; 2 -1.47,0.25; 3 -1.47,-0.25; 4 -1.47,-0.75; 9 1.47,-0.75; 10 1.47,-0.25; 11 1.47,0.25; 12 1.47,0.75 | smd 0.28 x 0.85: 5 -0.75,-1.47; 6 -0.25,-1.47; 7 0.25,-1.47; 8 0.75,-1.47; 13 0.75,1.47; 14 0.25,1.47; 15 -0.25,1.47; 16 -0.75,1.47
SO08 = smd 0.61 x 2.21: 1 -1.905,-2.616; 2 -0.635,-2.616; 3 0.635,-2.616; 4 1.905,-2.616; 5 1.905,2.616; 6 0.635,2.616; 7 -0.635,2.616; 8 -1.905,2.616
INDC1608X95N = smd 0.95 x 1: 1 -0.8,0; 2 0.8,0
MMCX_THROUGHHOLE_RIGHTANGLE = drill 0.9: G1 -1.27,1.27; G2 1.27,1.27; G3 1.27,-1.27; G4 -1.27,-1.27; S 0,0
RFM22-XXX-S2 = smd 2 x 1.3: 1 -8,7; 2 -8,5; 3 -8,3; 4 -8,1; 5 -8,-1; 6 -8,-3; 7 -8,-5; 8 -8,-7; 9 8,-7; 10 8,-5; 11 8,-3; 12 8,-1; 13 8,1; 14 8,3; 15 8,5; 16 8,7
LED-0603 = smd 0.8 x 0.8: A 0,-0.75; C 0,0.75
2.5X3.2CRYSTAL = smd 1 x 0.9: 1 -1.075,-0.775; 2 1.075,-0.775; 3 1.075,0.775; 4 -1.075,0.775
RESISTORARRAY_0804 = smd 0.33 x 0.5: 1 -0.775,-0.5; 4 0.775,-0.5; 5 0.775,0.5; 8 -0.775,0.5 | smd 0.28 x 0.5: 2 -0.25,-0.5; 3 0.25,-0.5; 6 0.25,0.5; 7 -0.25,0.5
RESC1005X40AN = smd 0.6 x 0.6: 1 -0.45,0; 2 0.45,0
JST-8PIN-SIDE = smd 0.6 x 1.55: 1 3.5,-2.8; 2 2.5,-2.8; 3 1.5,-2.8; 4 0.5,-2.8; 5 -0.5,-2.8; 6 -1.5,-2.8; 7 -2.5,-2.8; 8 -3.5,-2.8 | smd 1.2 x 2: NC1 4.8,1; NC2 -4.8,1
MICROUSB_TYPEB_SURFACE = smd 0.4 x 1.35: 1 -1.3,0.15; 2 -0.65,0.15; 3 0,0.15; 4 0.65,0.15; 5 1.3,0.15 | smd 1.8 x 1.9: MNT1 -4,-2.55; MNT2 4,-2.55 | smd 2.1 x 1.6: MNT3 3.05,0; MNT4 -3.05,0

### Placement (x,y rotation side)
AUX1  34,25.5 270 top
AUX2  34,25.55 90 bottom
AUX3  34,10.5 90 bottom
C1  8.75,16.95 270 top
C2  8.35,22 0 top
C3  11.45,16.25 180 top
C4  16.45,26.45 90 top
C5  13.7,13.3 180 top
C6  8.48,11.97 180 bottom
C7  26.25,9 270 top
C8  18.1,10.45 180 top
C9  14,14.45 180 top
C10  14.3,23 90 top
C11  30,22.2 0 top
C12  17.6,26.5 90 top
C13  2.65,13.5 270 bottom
C14  7.5,15 0 top
C15  5,28.8 180 top
C16  5.5,22.5 180 top
C18  8.5,19.2 0 top
C19  7,28 180 bottom
C20  19.4,23 180 bottom
C21  17.6,23 0 bottom
C22  25.05,9.05 270 top
C23  30.5,21 0 top
C24  3.15,22.5 0 top
C25  7.95,12.1 270 top
C26  9.2,12.1 90 top
D3  11.95,22.35 180 top
ENGINE1  26.94,32.08 270 top
ENGINE2  24.4,32.08 270 top
ENGINE3  21.86,32.08 270 top
ENGINE4  19.32,32.08 270 top
ENGINE5  16.78,32.08 270 top
ENGINE6  14.24,32.08 270 top
ENGINE7  11.7,32.08 270 top
ENGINE8  9.16,32.08 270 top
FLEX  34,10.45 270 top
IC1  22,18 270 top
IC2  4.85,26 270 top
IC3  11.32,26.54 0 top
IC4  4.5,19 90 top
IC5  23.04,26.59 0 top
IC6  12.05,18.65 270 top
IC7  17.5,7.25 90 top
IC8  28.5,7.25 90 top
IC9  4.5,13 0 top
IC10  26.7,26.6 0 top
IC11  9,7.25 270 top
IC12  23.05,7.25 270 top
IC13  5.91,8.58 270 bottom
L1  8.35,23.3 180 top
L2  20.2,7.3 270 top
L3  12.9,26.6 270 bottom
MMCX1  32.22,17.97 90 top
MODULE1  19.86,10.61 0 bottom
PWR  18.7,4.35 0 top
Q1  18.5,21 0 bottom
R1  11.05,12.1 180 top
R2  11.95,7.25 180 top
R3  14.55,7.25 180 top
R4  28.5,10.45 90 top
R5  28.85,24.35 180 top
R6  19.75,26.5 0 top
R7  14.65,26.5 0 top
R8  23.7,9.5 270 top
R9  22.7,9.5 270 top
R10  21.7,9.5 270 top
R11  19.39,23.95 180 bottom
R12  7,27.1 0 bottom
R13  6.5,7 270 top
R14  5.5,7 270 top
RC  12.5,2 180 top
SWD  2.02,25.5 270 bottom
U1  3.5,8.3 90 top
U2  3.5,9.5 90 top
USB1  24.37,4.02 0 top

### Tracks (layer width: path | path; a pad name or v marks a point on that pad's centre or on a via)
!SRST  (via drill 0.3)
  Top 0.2: IC1.7 15.15,18.75 14.9,19 14.9,19.6 v14.55,19.95 | v9.75,24.95 9.75,25.7 9.25,26.2 9.25,27.75 8,29 v7.5,29
  Bottom 0.2: SWD.3 5.57,26.02 R12.2 C19.1 6.55,28.05 v7.5,29 | v14.55,19.95 11.4,19.95 11.2,19.75 10.55,19.75 10.15,20.15 10.15,22.5 8.55,24.1 8.55,24.6 8.9,24.95 v9.75,24.95
+3V3  (via drill 0.3)
  Top 0.2: 14.45,13.55 C5.1 14.5,12.65 10.65,8.8 10.5,8.8 | 26.3,9.25 C7.1 | R2.4 11.18,8.12 10.5,8.8 | 10.5,8.8 7.1,8.8 v6.8,8.5 6.5,8.2 R13.1 R14.1 | 18.25,23.1 18.25,24.55 v17.7,24.55 | v8.5,27 8.5,26.3 9.15,25.65 v9.15,24.35
  Top 0.3: IC1.19 19.25,10.75 | IC1.13 15.2,15.75 14.45,15 | IC1.1 15.1,21.75 C10.1 | C9.1 14.45,15 | C11.1 29.2,22.2 28.75,21.75 IC1.48 27,21.75 26.8,21.55 25.95,21.55 26,21.4 | 19.2,22.7 18.65,22.7 18.25,23.1 IC1.64 18.25,24.55 17.6,25.2 C12.1 16.85,26.05 C4.1 | 23.2,13.75 25.15,13.75 25.55,13.35 | 14.55,13.55 C5.1 | C8.1 18.95,10.45 19.25,10.75 | v19.45,10.9 19.25,10.75 | v14.8,15 14.45,15 | IC1.32 25.8,12.05 25.85,12
  Top 0.4: v27.15,9.25 26.3,9.25 | v9.45,14.1 10.7,14.1 12.25,15.65 C3.1
  Top 0.5: C9.1 14.45,13.55 | 23.2,13.75 22.15,14.8 v19.4,14.8 | v15.15,13.55 14.55,13.55 | v15.35,22.7 15.2,22.55 C10.1 | v13.2,21.25 13.2,20.3 13.5,20 13.5,19.85 IC6.5 13.35,19.3 12.3,18.25 12.3,16.5 C3.1 12.75,16.25 v13.4,16.9 | v9.15,24.35 L1.1 | C7.1 26.25,10.2 25.85,10.6 25.85,12 25.85,13.05 25.55,13.35
  Top 0.6: 26,21.4 20.5,21.4 19.2,22.7
  Bottom 0.2: IC13.8 IC13.7 2.46,9.21 | IC13.3 6.8,7.95 v6.8,8.5 | v8.5,27 8.4,27.1 R12.1
  Bottom 0.4: IC13.8 6.68,10.48 8.03,11.83 C6.1 8.03,12.68 v9.45,14.1
  Bottom 0.5: MODULE1.5 27.14,9.61 v27.15,9.25 | v15.15,13.55 16.4,14.8 v19.4,14.8 19.95,14.8 21.25,13.5 21.25,12.85 20.55,12.15 19.6,12.15 19.25,11.8 19.25,11.1 v19.45,10.9 | v17.7,24.55 16.55,24.55 15.35,23.35 v15.35,22.7 14.65,22.7 v13.2,21.25 12.25,21.25 v9.15,24.35 | v13.4,16.9 14.8,15.5 v14.8,15
+5V  (via drill 0.3)
  Top 0.4: 12.8,0.8 12.9,0.7 15.5,0.7 15.6,0.8
  Top 0.6: ENGINE1.2 30.92,32.08 33,30 33,25 | 33,25 33,22.2 35,20.2 35,15.8 33,13.8 33,13 | AUX1.2 32.5,25.02 | 32.5,25.02 32.98,25.02 33,25 | v32.5,25.5 32.5,25.02 | 33,13 34.4,11.6 34.4,9.4 33.4,8.4 33.4,7.9 30.5,5 v30.5,2.5 | FLEX.2 32.27,9.97 v32.6,10.3 | 33,13 v32.6,12.6 | RC.2 v10,4.1 | v10,1.7 10.9,0.8 12.8,0.8 | 15.6,0.8 17.5,0.8 | 17.5,0.8 v18.1,0.8 | RC.NC2 17.5,0.8
  Top 0.8: ENGINE8.2 ENGINE7.2 | ENGINE5.2 ENGINE4.2 ENGINE3.2 ENGINE2.2 ENGINE1.2
  Bottom 0.6: L3.1 12.95,27.45 12.95,32.03 12.9,32.08 | AUX2.2 31.97,26.03 v32.5,25.5 | v32.6,10.3 32.2,10.7 | 32.2,10.7 31.92,10.98 AUX3.2 | v32.6,12.6 32.6,11.1 32.2,10.7 | v10,4.1 v10,1.7 | v18.1,0.8 28.8,0.8 v30.5,2.5
  Bottom 0.8: ENGINE7.2 12.9,32.08 ENGINE6.2 ENGINE5.2
CAN_RX
  Top 0.2: IC1.33 27.7,14.25 27.7,11.3 27.77,11.22 R4.5
CAN_TX
  Top 0.2: IC1.34 27.15,14.75 26.9,14.5 26.9,14.05 27.3,13.65 27.3,11.1 27.7,10.7 R4.6
CONTROLL1_IN
  Top 0.2: IC1.26 22.75,12.85 21.8,13.8 18.65,13.8 14.8,9.95 R3.2
CONTROLL2_IN
  Top 0.2: IC1.27 23.25,12.9 21.95,14.2 18.45,14.2 14.3,10.05 R3.3
CONTROLL3_IN
  Top 0.2: R3.4 13.78,10.12 19.1,15.45 21.45,15.45 21.55,15.35 22.55,15.35 22.65,15.45 26.55,15.45 26.75,15.25 IC1.35
CONTROLL4_IN
  Top 0.2: R2.1 12.72,9.62 18.95,15.85 21.7,15.85 21.8,15.75 22.4,15.75 22.5,15.85 26.85,15.85 26.95,15.75 IC1.36
CONTROLL5_IN
  Top 0.2: R2.2 12.2,9.65 16.05,13.5 IC1.16
CONTROLL6_IN
  Top 0.2: R3.1 15.32,9.88 17.5,12.05 IC1.17
D_N  (via drill 0.3)
  Top 0.2: R9.1 22.7,10.65 v22.6,10.8 | v22.85,20.15 22.85,19.6 23.3,19.15 26.5,19.15 27.1,19.75 IC1.44
  Bottom 0.2: v22.85,20.15 22.85,19.7 20.4,17.25 20.4,16.3 23.2,13.5 23.2,11.6 22.6,11 v22.6,10.8
D_P  (via drill 0.3)
  Top 0.2: R8.1 v23.35,10.5 | IC1.45 26.95,20.25 26.25,19.55 23.9,19.55 v23.6,19.85
  Bottom 0.2: v23.6,19.85 20.8,17.1 20.8,16.45 23.65,13.6 23.65,11.4 23.35,11.1 v23.35,10.5
ENGINE1_PWM
  Top 0.2: R6.1 18.98,25.52 19.25,25.25 IC1.62
ENGINE2_PWM
  Top 0.2: R6.2 19.5,25.65 19.75,25.4 IC1.61
ENGINE3_PWM
  Top 0.2: R6.3 20,25.75 20.75,25 IC1.59
ENGINE4_PWM
  Top 0.2: R6.4 20.52,25.82 21.25,25.1 IC1.58
ENGINE5_PWM
  Top 0.2: IC1.40 23.25,17.75 19,22 18.7,22 15.43,25.27 R7.4
ENGINE6_PWM
  Top 0.2: IC1.39 23.2,17.25 18.85,21.6 18.55,21.6 14.9,25.25 R7.3
ENGINE7_PWM
  Top 0.2: IC1.38 23.15,16.75 18.7,21.2 18.4,21.2 14.4,25.2 R7.2
ENGINE8_PWM
  Top 0.2: IC1.37 23.1,16.25 18.55,20.8 18.25,20.8 13.88,25.18 R7.1
FLASH_SEL  (via drill 0.3)
  Top 0.2: IC1.24 21.75,12.9 21.45,13.2 v20.5,13.2
  Bottom 0.2: IC13.1 10.69,10.48 10.85,10.65 13.1,10.65 13.65,11.2 17.8,11.2 19.3,12.7 20,12.7 v20.5,13.2
GND  (via drill 0.3)
  Top 0.2: IC9.9 6.35,12.25 6.6,12 6.9,12 6.9,11.4 7,11.3 C25.2 | C9.2 13.55,14.75 13.95,15.15 | C8.2 17.65,11.05 18.65,11.05 18.75,11.15 IC1.18
  Top 0.28: IC9.11 v6.95,13.25
  Top 0.4: 12.9,13.4 12.9,14.1 13.25,14.45
  Top 0.5: IC6.2 11.6,18.65 | 11.15,18.65 11.35,18.65 11.75,19.05
  other vias: 22.65,28.35 10.9,28.4 2,11.9 6.85,11.7 4.35,22.5 5.15,17.95 16.85,10.45 15.85,7.25 19.65,18.2 13.35,12.35 21.5,20.5 25.95,20.25 17.35,18.25 3.55,19.95 9,5.85 30.55,7.85 10.3,14.9 7.5,18.35 5,16.05 1.05,23.95 7.55,29.95 13.75,24.3 8.5,22 18.35,25.45 18.05,29.95 27.8,28.4 32.05,28.3 27.35,30.8 35,4.5 31.5,1 25.85,7.45 18.7,5.9 19.15,8.35 6,1.5 1.7,5.75 35,21.5 35,31.5 31.5,35 4.5,35 1,31.5 35,14.5 9,1.5 29.5,12 29.5,13.5 29.5,15 31,15 32.5,15 31,13.5 29.5,20 32.5,21 32,23 21.9,2.4 12.15,19.3 8.5,25.4 4.7,7.3 29.5,16.5
  pour Bottom (isolate 0.2): 0,36 36,36 36,0 0,0
  pour Top (isolate 0.2): 0,36 36,36 36,0 0,0
  cutout Top: 3,11.5 3,14.5 6,14.5 6,11.5
  cutout Bottom: 3,11.5 3,14.5 6,14.5 6,11.5
MAG_INT  (via drill 0.3)
  Top 0.2: IC9.15 4.25,15.9 v4.1,16.05 | IC1.2 14.8,21.25 14.25,21.8 13.95,21.8 13.45,22.3 11.25,22.3 10.9,21.95 10.9,21.3 10.4,20.8 10.1,20.8 9.55,20.25 7.85,20.25 7.1,21 v7,21
  Bottom 0.2: v4.1,16.05 4.1,17.15 3.15,18.1 2.05,18.1 1.95,18.2 1.95,20.3 2.2,20.55 6.95,20.55 v7,21
MPU_INT  (via drill 0.3)
  Top 0.2: IC4.12 7.25,20.25 7.65,19.85 9.75,19.85 10.25,20.35 v10.85,20.35 | v14.2,20.9 14.35,20.75 IC1.3
  Bottom 0.2: v10.85,20.35 13.65,20.35 v14.2,20.9
N$1
  Top 0.28: IC9.10 6.5,12.75 6.8,12.45 7.55,12.45 C25.1
N$2
  Top 0.2: R8.2 23.7,8.95 23.25,8.5 23.25,7.9 | 23.25,7.9 IC12.6 | 23.25,7.9 23.25,6.25 24.37,5.12 USB1.3
N$3
  Top 0.2: ENGINE8.3 9.71,28.99 9.71,26.4 10.47,25.64 IC3.1 10.67,25.27 11.05,24.9 12.15,24.9 13.4,26.15 13.4,27.1 13.6,27.3 13.85,27.3 13.85,27.02 R7.8
N$4
  Top 0.2: R7.7 14.4,27.45 14.1,27.75 13.45,27.75 13,27.3 13,26.75 12.6,26.35 11.97,26.35 | 11.97,26.35 10.45,26.35 10.15,26.65 10.15,28.65 11.04,29.54 ENGINE7.3 | IC3.3 11.97,26.35
N$5
  Top 0.2: R7.6 14.9,28.88 ENGINE6.3 14.24,29.14 12.6,27.5 12.6,27 12.35,26.75 10.95,26.75 10.67,27.03 IC3.6
N$6  (via drill 0.3)
  Top 0.2: R5.2 29.1,25.5 29.35,25.75 v29.85,25.75 | IC10.4 v28.15,27.5
  Bottom 0.2: AUX2.3 30.27,25.03 29.85,25.45 v29.85,25.75 28.15,27.45 v28.15,27.5
N$7
  Top 0.2: R9.2 22.85,8.9 22.85,7.9 | 22.85,7.9 IC12.1 | USB1.2 23.72,5.07 22.85,5.95 22.85,7.9
N$8
  Top 0.28: IC9.8 5.25,11 5.8,10.45 8.95,10.45 9.2,10.7 C26.1
N$9
  Top 0.2: R2.5 11.18,6.42 11.05,6.3 10.8,6.3 10.6,6.5 10.6,8.1 10.3,8.4 7.7,8.4 7.4,8.1 7.4,3.9 8.2,3.1 12.7,3.1 13.3,2.5 17,2.5 18.1,3.6 PWR.A
N$10
  Top 0.28: IC9.12 6.4,13.75 6.55,13.9 8.6,13.9 9.2,13.3 C26.2
N$11
  Top 0.2: R1.5 10.28,10.97 9.3,10 4.75,10 U2.A
N$12
  Top 0.2: IC3.4 12.02,27.52 13,28.5 13,30.05 13.75,30.8 14.82,30.8 16.37,29.25 16.37,29.13 | R7.5 15.43,28.18 16.37,29.13 | 16.37,29.13 ENGINE5.3
N$13
  Top 0.3: IC4.10 8,19.25 C18.1
N$14
  Top 0.3: IC4.20 1.85,19.75 1.7,19.9 1.7,21.5 C24.1
N$16
  Top 0.2: R6.6 20,27.35 20.4,27.75 21.15,27.75 21.45,27.45 21.45,26.55 21.6,26.4 22.5,26.4 | 22.5,26.4 23.85,26.4 24.2,26.75 24.2,29.34 ENGINE2.3 | IC5.1 22.39,26.39 22.5,26.4
N$17
  Top 0.2: R6.5 20.52,27.27 20.6,27.35 20.95,27.35 21.05,27.25 21.05,25.95 22,25 23.5,25 23.69,25.19 IC5.3 23.84,25.64 24.6,26.4 24.6,28.2 25.94,29.54 ENGINE1.3
N$18
  Top 0.2: R1.6 10.8,10.9 9.5,9.6 5.55,9.6 U1.A
N$19  (via drill 0.3)
  Top 0.2: IC1.60 20.25,23.15 20.65,22.75 v20.9,22.75
  Bottom 0.2: v20.9,22.75 20.9,23.4 20.35,23.95 R11.2
N$20
  Top 0.2: IC1.8 15.15,18.25 14.6,17.7 14.6,17.2 10.28,12.88 R1.4
N$21  (via drill 0.3)
  Top 0.4: D3.2 10.2,22.65 10.2,21.6 9.55,20.95 v8.15,20.95 | L2.2 19.55,5.85 19.55,3.05 v18.45,1.95
  Bottom 0.4: v8.15,20.95 8.15,21.2 6.9,22.45 6.1,22.45 5.25,21.6 1.75,21.6 0.75,20.65 0.75,17.4 1.15,17.05 2.5,17.05 2.8,16.75 2.8,15.95 1,14.15 0.95,5.55 1.5,5 3.65,5 5,3.65 5,1.5 6,0.5 16.75,0.5 17.8,1.55 18.05,1.55 v18.45,1.95
N$22
  Top 0.2: IC5.6 22.39,27.71 21.55,28.55 19.35,28.55 | 19.35,28.55 19.35,29.52 ENGINE4.3 | R6.8 18.98,28.18 19.35,28.55
N$23
  Top 0.2: R2.7 12.2,6.3 11.8,5.9 11.6,5.9 11.1,5.4 | 11.1,5.4 11.1,4.9 RC.3 | IC11.4 11.1,5.4
N$24
  Top 0.2: IC1.9 15.25,17.75 15,17.5 15,17 10.8,12.8 R1.3
N$25  (via drill 0.3)
  Top 0.2: IC1.6 17.25,19.25 17.7,18.8 v18.7,18.8
  Bottom 0.2: C20.2 19.85,22.8 20.4,22.25 20.4,21.05 Q1.1 19.57,19.68 v18.7,18.8
N$26  (via drill 0.3)
  Top 0.2: v18.3,19.5 18.05,19.75 IC1.5
  Bottom 0.2: C21.2 17.15,22.05 Q1.3 18.5,20.7 18.5,19.7 v18.3,19.5
N$27
  Top 0.2: R3.8 15.32,6.38 15.6,6.1 | 15.6,6.1 16,5.7 RC.8 | IC7.6 16.1,6.6 15.6,6.1
N$28
  Top 0.2: R3.5 13.78,6.28 13,5.5 RC.5 13,3.4 13.5,2.9 16.8,2.9 17.5,3.6 17.5,5.3 18.1,5.9 18.1,6.6 IC7.1
N$29
  Top 0.2: R6.7 19.5,27.5 20.15,28.15 21.35,28.15 21.85,27.65 21.85,27 22.05,26.8 23.5,26.8 23.69,26.99 IC5.4 23.69,28.21 22.36,29.54 ENGINE3.3
N$30
  Top 0.2: R4.4 29.88,11.22 30.62,11.97 FLEX.4 33.03,11.97 33.7,11.3 33.7,9.6 32.7,8.6 32.7,8.2 30.6,6.1 29,6.1 28.5,6.6 IC8.6
N$31
  Top 0.2: R4.3 30.2,10.7 30.47,10.97 FLEX.3 32.93,10.97 33.3,10.6 33.3,9.8 32.3,8.8 32.3,8.4 30.5,6.6 IC8.1
N$35  (via drill 0.3)
  Top 0.2: v22.05,19.8 23.1,18.75 IC1.42 | R10.1 21.7,10.35 v21.85,10.5
  Bottom 0.2: v22.05,19.8 22.15,19.7 22.15,19.55 20,17.4 20,16.15 22.8,13.35 22.8,11.85 21.85,10.9 v21.85,10.5
N$40  (via drill 0.3)
  Top 0.2: v30.45,23.1 30.1,23.45 30.1,25.1 30.07,25.12 29.62,25.12 R5.1 | IC10.6 26.05,26.9 v25.8,26.65
  Bottom 0.2: v30.45,23.1 30.45,23.29 AUX2.4 31.16,24 30.1,24 29.2,24.9 29.2,25.8 28.35,26.65 v25.8,26.65
N$44
  Top 0.2: 25.25,10 C22.1
  Top 0.3: IC1.31 25.25,10
N$45  (via drill 0.3)
  Top 0.5: D3.1 v12.9,24.65
  Bottom 0.5: v12.9,24.65 L3.2
N$46
  Top 0.2: R2.8 12.72,6.22 12,5.5 RC.4 12,3.8 11.7,3.5 8.5,3.5 8.1,3.9 IC11.3
N$49
  Top 0.2: R3.6 14.3,6 14,5.7 RC.6 14,3.6 14.3,3.3 16.6,3.3 17.1,3.8 17.1,5.5 17.7,6.1 17.7,7.55 18.05,7.9 IC7.3
N$50
  Top 0.2: 29.6,21.25 C23.1
  Top 0.3: IC1.47 29.6,21.25
N$51
  Top 0.2: R5.4 28.07,25.5 | 28.07,25.5 28.07,25.77 29.32,27.02 AUX1.4 | IC10.3 27.88,25.7 28.07,25.5
N$52
  Top 0.2: R5.3 28.6,25.6 29.35,26.35 30.86,26.35 AUX1.3 32.07,26.02 32.3,26.25 32.3,27.3 32,27.65 29.35,27.65 28.2,26.5 26.5,26.5 26.05,26.05 IC10.1
N$55  (via drill 0.3)
  Top 0.2: IC8.4 27.6,8.28 R4.1 29.32,9.68 29.45,9.55 29.45,9 v29.4,8.95
  Bottom 0.2: v29.4,8.95 29.72,8.98 AUX3.4
N$56
  Bottom 0.6: MMCX1.S 28.5,17.97 MODULE1.1
N$67
  Bottom 0.2: MODULE1.6 27.69,7.61 26.5,8.8 26.5,10.7 27.41,11.61 MODULE1.4
N$68
  Bottom 0.2: MODULE1.7 26.55,6.92 26.55,8.15 26.1,8.6 26.1,10.9 26.55,11.35 26.55,12.25 27.86,13.56 MODULE1.3
N$70  (via drill 0.3)
  Top 0.2: R4.2 29.75,10.2 v29.85,10.1 30,9.95 30,8.5 IC8.3
  Bottom 0.2: v29.85,10.1 29.97,9.98 AUX3.3
N$78
  Top 0.2: R3.7 14.8,6 15,5.8 RC.7 15,3.8 15.1,3.7 16.4,3.7 16.7,4 16.7,5.7 17.3,6.3 17.3,7.55 16.95,7.9 IC7.4
RF_IRQ  (via drill 0.3)
  Top 0.2: IC1.4 18.55,20.25 20.55,18.25 20.55,17.35 20.25,17.05 v18,17.05
  Bottom 0.2: 17.9,16.9 v18,17.05 17.75,17.05 14.31,13.61 MODULE1.14
RF_MISO  (via drill 0.3)
  Top 0.2: IC1.22 20.75,10.75 19.4,9.4 17.15,9.4 16.8,9.05 v16.7,9.05
  Bottom 0.2: MODULE1.10 11.84,5.61 10.55,6.9 10.55,8.3 10.62,8.38 | 10.62,8.38 10.85,8.6 13,8.6 13.4,9 16.65,9 v16.7,9.05 | IC13.2 9.79,9.21 10.62,8.38
RF_MOSI  (via drill 0.3)
  Top 0.2: IC1.23 21.25,10.65 19.55,8.95 17.65,8.95 v17.5,8.8
  Bottom 0.2: v17.5,8.8 17.1,8.4 13.45,8.4 13.1,8.05 12.3,8.05 MODULE1.11 13.25,6.22 13.25,5 12.85,4.6 10.85,4.6 10.15,5.3 10.15,7.05 9.85,7.35 6.35,7.35 5.67,6.67 IC13.5
RF_SCLK  (via drill 0.3)
  Top 0.2: IC1.21 20.25,10.85 19.2,9.8 v16.25,9.8
  Bottom 0.2: v16.25,9.8 16.15,9.8 15.96,9.61 MODULE1.12 11.62,9.85 6.85,9.85 4.95,7.95 IC13.6
RF_SEL  (via drill 0.3)
  Top 0.2: IC1.20 19.75,12.8 19.35,13.2 v19,13.2
  Bottom 0.2: MODULE1.13 17.41,11.61 v19,13.2
RXD3
  Top 0.2: IC1.52 24.25,24.75 24.5,25 26.15,25 27.65,23.5 27.95,23.5 28.07,23.62 R5.5
RXD4  (via drill 0.3)
  Top 0.2: R4.8 27.62,9.68 26.5,10.8 26.5,13.2 25.45,14.25 23.85,14.25 23.4,14.7 v23.4,14.75 | IC1.15 17.25,14.75 18.75,16.25 22.15,16.25 v22.1,16.35
  Bottom 0.2: v22.1,16.35 22.1,16.15 v23.4,14.75
RXD5
  Top 0.2: R5.8 29.62,23.27 28.65,22.3 26.8,22.3 26.5,22 23.8,22 23.25,22.55 IC1.54
SCL  (via drill 0.3)
  Top 0.2: IC2.8 6.85,24.45 5.6,23.2 2.4,23.2 1.2,22 1.2,18.5 1.45,18.25 | IC4.23 1.45,18.25 | 1.4,15.5 1.4,18.2 1.45,18.25 | 1.4,15.5 2.65,14.25 2.65,13.75 IC9.1 | IC1.29 24.25,11.15 v24.55,10.85 | v14.5,1.85 13.35,1.85 12.5,2.7 8,2.7 6.5,4.2 6.5,6.4 | R13.2 6.5,6.4 | 6.5,6.4 v6.15,6 | v4.85,5.95 3.05,5.95 1.25,7.75 1.25,15.35 1.4,15.5
  Bottom 0.2: v24.55,10.85 24.55,7.2 21.3,3.95 17.15,3.95 15.7,2.5 15.15,2.5 v14.5,1.85 | v6.15,6 6.1,5.95 v4.85,5.95
SDA  (via drill 0.3)
  Top 0.2: IC4.24 1.95,17.75 1.8,17.6 1.8,16.35 | IC2.7 5.4,23.95 5.1,23.65 2.25,23.65 0.8,22.2 v0.8,16.35 0.8,7.55 3,5.35 5.5,5.35 | IC9.16 3.75,15.35 3.6,15.5 2.5,15.5 1.8,16.2 1.8,16.35 | v2.05,16.35 1.8,16.35 | IC1.30 v24.75,13.1 | v15.65,1.85 15.05,1.25 13.35,1.25 12.3,2.3 7.8,2.3 5.5,4.6 5.5,5.35 | 5.5,5.35 R14.2
  Bottom 0.2: v0.8,16.35 v2.05,16.35 | v24.75,13.1 24.75,11.5 25.15,11.1 25.15,10.55 25,10.4 25,7 21.5,3.5 17.3,3.5 v15.65,1.85
SWCLK  (via drill 0.3)
  Top 0.2: IC1.49 26.25,23.95 v26.45,23.75 | v25.3,30.6 16.1,30.6 15.3,31.4 15.3,32.55 14.7,33.15 13.8,33.15 13.2,32.55 13.2,31.3 12.5,30.6 4.25,30.6 1.45,27.8 1.45,26.95 1.6,26.8 1.6,26.1 v1,25.5
  Bottom 0.2: v26.45,23.75 24.3,26 24.3,27.7 25.45,28.85 25.45,30.45 v25.3,30.6 | v1,25.5 1.4,25.5 2.88,24.02 SWD.1
SWDIO  (via drill 0.3)
  Top 0.2: IC1.46 26.7,20.75 v26.6,20.85 | v26.2,30.8 25.8,31.2 25.05,31.2 24.85,31 16.3,31 15.7,31.6 15.7,32.75 14.9,33.55 13.6,33.55 12.8,32.75 12.8,31.55 12.25,31 4,31 1,28 v1,26.5
  Bottom 0.2: v26.6,20.85 27.1,21.35 27.1,24 26.7,24.4 26.5,24.4 24.7,26.2 24.7,27.4 25.9,28.6 25.9,30.5 v26.2,30.8 | v1,26.5 2.5,25 4.81,25 SWD.2
TXD3
  Top 0.2: R5.6 28.6,23.45 28.25,23.1 26.3,23.1 26.05,22.85 25,22.85 24.75,23.1 IC1.51
TXD4  (via drill 0.3)
  Top 0.2: R4.7 27.65,10.2 26.9,10.95 26.9,13.45 25.5,14.85 v24.4,14.85 | IC1.14 17.15,15.25 18.55,16.65 21.2,16.65 v21.4,16.85
  Bottom 0.2: v21.4,16.85 21.5,16.95 22.4,16.95 22.8,16.55 22.8,16.45 v24.4,14.85
TXD5
  Top 0.2: R5.7 29.1,23.35 28.45,22.7 26.55,22.7 26.25,22.4 24.05,22.4 23.75,22.7 IC1.53
V_RC
  Top 0.5: D3.3 11.95,20.35 11.2,19.6 IC6.1 10.25,19.6 9.7,19.05 9.7,17.9 | 9.7,17.9 9.9,17.7 IC6.3 | C1.1 9.65,17.75 9.7,17.9
VCC
  Top 0.2: R10.2 21.7,9 21.4,8.7 21.4,7.6 21.75,7.25 IC12.2
  Top 0.4: USB1.1 23.07,4.83 22.25,5.65 21.95,5.65 21.3,6.3 21.3,6.85 | IC12.2 21.7,7.25 21.3,6.85 | L2.1 20.1,8.05 21.3,6.85
VCCA  (via drill 0.3)
  Top 0.2: IC9.4 2.55,12.25 2.3,12.5 2.3,13.25
  Top 0.28: IC9.2 2.3,13.25 | IC9.13 5.25,15.05 5.5,15.3 v6.45,15.3
  Top 0.3: 5.75,18.75 IC4.13 5.75,22.4 C16.1 7.55,22.5 | 5.75,18.75 5.75,18.35 5.85,18.25 IC4.8 | IC4.9 5.75,18.75 | v6.45,21.7 6.75,22 C2.1 | C14.1 6.75,15 v6.45,15.3 | 2.3,13.25 1.95,13.65 v1.95,13.95
  Top 0.4: L1.2 7.8,23.55 7.8,26.38 IC2.1
  Top 0.5: IC2.1 IC2.2 5.47,28.73 C15.1
  Top 0.6: C2.1 7.55,22.5 L1.2
  Bottom 0.28: v6.45,15.3 3.4,15.3
  Bottom 0.3: v1.95,13.95 3.3,15.3 3.4,15.3 3.4,17.2 2.95,17.65 1.85,17.65 1.5,18 1.5,20.5 2,21 IC4.13 v6.45,21.7
  Bottom 0.4: C13.1 v1.95,13.95

### Text on the board
tPlace: GND | OUT | V+ | SIG | 8 | 1 | KFly
bPlace: By Emil Fresk | emil.fresk@ltu.se | LTU, Sweden | Rev 3
_bsilk: RST | IO | CLK